# Altium schematic sheet BIN.SchDoc
size A; CompanyName: Microchip Technology Inc.; Organization: Microchip Technology; Address1: 2355 West Chandler Blvd.; Address2: Chandler, AZ  85224; Address4: USA; DocumentNumber: 4; SheetNumber: 4; SheetTotal: 5; SheetTitle: Bus Interface Network; Time: Time
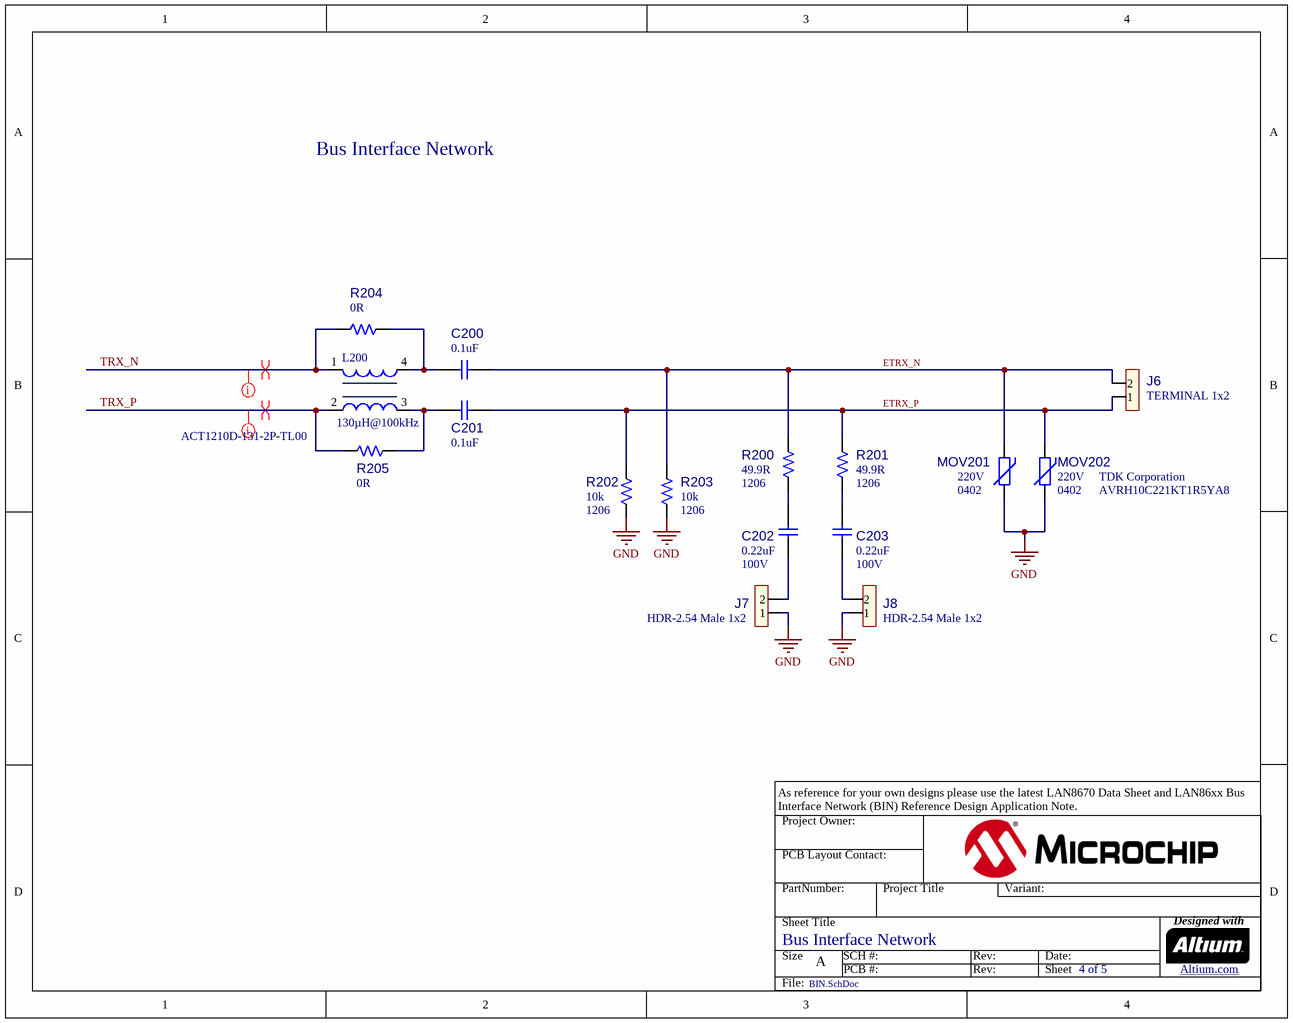
[diagram p0: BIN.SchDoc]

## Parts
C200  value 0.1uF  [CAP_C_0402]  (hidden comment: Capacitor NP)
C201  value 0.1uF  [CAP_C_0402]  (hidden comment: Capacitor NP)
C202  value 0.22uF  Voltage: 100V  [CAP_C_0805]  (hidden comment: Capacitor NP)
C203  value 0.22uF  Voltage: 100V  [CAP_C_0805]  (hidden comment: Capacitor NP)
J6  value TERMINAL 1x2  [CON_TB_3.5mm_2POS_WE_WR-TBL-691214110002S]  (hidden comment: Header 1x2)
J7  value HDR-2.54 Male 1x2  [HDR_M_2.54_1x2]  (hidden comment: Header 1x2)
J8  value HDR-2.54 Male 1x2  [HDR_M_2.54_1x2]  (hidden comment: Header 1x2)
L200  value 130µH@100kHz  Manufacturer Part Number 1: ACT1210D-131-2P-TL00  [IND_TDK_ACT1210D_L3.9W2.5H2.5]  (hidden comment: Inductor Choke ACT1210)
MOV201  value 220V  Package: 0402  [RES_C_0402]  (hidden comment: Varistor)
MOV202  value 220V  Package: 0402  Manufacturer 1: TDK Corporation  Manufacturer Part Number 1: AVRH10C221KT1R5YA8  [RES_C_0402]  (hidden comment: Varistor)
R200  value 49.9R  Package: 1206  [RES_C_1206]  (hidden comment: Resistor)
R201  value 49.9R  Package: 1206  [RES_C_1206]  (hidden comment: Resistor)
R202  value 10k  Package: 1206  [RES_C_1206]  (hidden comment: Resistor)
R203  value 10k  Package: 1206  [RES_C_1206]  (hidden comment: Resistor)
R204  value 0R  [RES_C_0402]  (hidden comment: Resistor)
R205  value 0R  [RES_C_0402]  (hidden comment: Resistor)

## Nets
GND: J7.1 J8.1 MOV201.1 MOV202.1 R202.2 R203.2
ETRX_N: C200.2 J6.2 MOV201.2 R200.2 R203.1
ETRX_P: C201.2 J6.1 MOV202.2 R201.2 R202.1
TRX_N: L200.1 R204.1
TRX_P: L200.2 R205.1
NetC200_1: C200.1 L200.4 R204.2
NetC201_1: C201.1 L200.3 R205.2
NetC202_1: C202.1 J7.2
NetC202_2: C202.2 R200.1
NetC203_1: C203.1 J8.2
NetC203_2: C203.2 R201.1

## Layout directives
differential pair: TRX_N, TRX_P
net class 100 Ohm Diff: TRX_N, TRX_P

## Notes on the sheet
- As reference for your own designs please use the latest LAN8670 Data Sheet and LAN86xx Bus Interface Network (BIN) Reference Design Application Note.
- Project Owner:
- PCB Layout Contact:
- PartNumber:
- Project Title
- Variant:
- Sheet Title
- Size
- A
- SCH #:
- PCB #:
- Rev:
- Date:
- Sheet
- Designed with
- Altium.com <http://go.altium.com/MicrochipLandingPage_Evaluation.html>
- File:

## Library data of the parts
C200 C201 = CAP2375: Manufacturer 1: Murata Electronics; Manufacturer Part Number 1: GRM155R71H104KE14J; Voltage: 50V; Tolerance: 10%; Description_: Ceramic capacitor, SMD 0402, X7R, 50V, +/-10%; Temperature Coeffcient: X7R; Type: Ceramic; Owner: Dragos Danaila; Populated: YES; Dev Tools Status: Production; MCHP-ID: CAP2375; Revision: 1; Status: MCL Design; Package: 0402; Operating Temperature: -55C to +125C; Category: Capacitor; Supplier 1: Mouser Electronics; Supplier Part Number 1: 81-GRM155R71H104KE4J; Quantity Override: 1; Symbol: Capacitor NP; ComponentLink1URL: https://chn-vm-apps.microchip.com/mchprepo/parts/Datasheets/murata_03052018_GRM_Series_1-1310166.pdf; ComponentLink1Description: SVN Datasheet; ComponentLink2URL: C:\ALTIUM_WORK\00001_MCHP-CDB\Datasheets\murata_03052018_GRM_Series_1-1310166.pdf; ComponentLink2Description: Local Datasheet; ComponentLink3URL: C:\ALTIUM_WORK\00001_MCHP-CDB\Library\LibraryRefs\Capacitor NP.SchLib; ComponentLink3Description: Open Symbol; ComponentLink4URL: C:\ALTIUM_WORK\00001_MCHP-CDB\Library\Footprints\CAP_C_0402.PcbLib; ComponentLink4Description: Open Footprint; ComponentLink5Description: Open Footprint 2; ComponentLink6Description: Open Footprint 3; ComponentLink7Description: Open Footprint 4
C202 C203 = CAP2522: Manufacturer 1: AVX Corporation; Manufacturer Part Number 1: 08051C224K4T2A; Description_: CAP CER 0.22uF 100V 10% X7R SMD 0805 AEC-Q200; Tolerance: ±10%; Type: Ceramic; Owner: Lori Graham; Populated: YES; Temperature Coeffcient: X7R; Dev Tools Status: Design; MCHP-ID: CAP2522; Package: 0805; Revision: 1; Status: MCL Design; Operating Temperature: -55°C to +125°C; Category: Capacitor; Supplier 1: Digi-Key; Supplier Part Number 1: 478-13049-1-ND; Quantity Override: 1; Symbol: Capacitor NP; ComponentLink1URL: https://chn-vm-apps.microchip.com/mchprepo/parts/Datasheets/AVX_08051C224K4T2A; ComponentLink1Description: SVN Datasheet; ComponentLink2URL: C:\ALTIUM_WORK\00001_MCHP-CDB\Datasheets\AVX_08051C224K4T2A; ComponentLink2Description: Local Datasheet; ComponentLink3URL: C:\ALTIUM_WORK\00001_MCHP-CDB\Library\LibraryRefs\Capacitor NP.SchLib; ComponentLink3Description: Open Symbol; ComponentLink4URL: C:\ALTIUM_WORK\00001_MCHP-CDB\Library\Footprints\CAP_C_0805.PcbLib; ComponentLink4Description: Open Footprint; ComponentLink5Description: Open Footprint 2; ComponentLink6Description: Open Footprint 3; ComponentLink7Description: Open Footprint 4
J6 = CON2397: Manufacturer 1: WUERTH ELEKTRONIK; Manufacturer Part Number 1: 691214110002S; Description_: CON TERMINAL 3.5mm 1x2 Female 16-30AWG 10A TH R/A; Owner: Lori Graham; Populated: YES; Dev Tools Status: Design; Voltage: 300V; Current: 10A; MCHP-ID: CON2397; Revision: 1; Status: MCL Design; Type: Terminal Block; Category: Connector; Supplier 1: Digi-Key; Supplier Part Number 1: 732-691214110002S-ND; Quantity Override: 1; Symbol: Header 1x2; ComponentLink1URL: https://chn-vm-apps.microchip.com/mchprepo/parts/Datasheets/6912141100xxS.pdf; ComponentLink1Description: SVN Datasheet; ComponentLink2URL: C:\ALTIUM_WORK\00001_MCHP-CDB\Datasheets\6912141100xxS.pdf; ComponentLink2Description: Local Datasheet; ComponentLink3URL: C:\ALTIUM_WORK\00001_MCHP-CDB\Library\LibraryRefs\Header 1x2.SchLib; ComponentLink3Description: Open Symbol; ComponentLink4URL: C:\ALTIUM_WORK\00001_MCHP-CDB\Library\Footprints\CON_TB_3.5mm_2POS_WE_WR-TBL-691214110002S.PcbLib; ComponentLink4Description: Open Footprint; ComponentLink5Description: Open Footprint 2; ComponentLink6Description: Open Footprint 3; ComponentLink7Description: Open Footprint 4; Operating Temperature: -30C to +120C
J7 J8 = CON2326: Manufacturer 1: Samtec Inc; Manufacturer Part Number 1: TSW-102-23-F-S; Description_: CON HDR-2.54 M 1x2 5.84MH TH VERT; Owner: Lori Graham; Populated: YES; Dev Tools Status: Design; MCHP-ID: CON2326; Revision: 1; Status: MCL Design; Type: Header 2.54mm; Category: Connector; Supplier 1: Digi-Key; Supplier Part Number 1: SAM10326-ND; Quantity Override: 1; Symbol: Header 1x2; ComponentLink1URL: https://chn-vm-apps.microchip.com/mchprepo/parts/Datasheets/Samtec_TSW_102-23-F-S; ComponentLink1Description: SVN Datasheet; ComponentLink2URL: C:\ALTIUM_WORK\00001_MCHP-CDB\Datasheets\Samtec_TSW_102-23-F-S; ComponentLink2Description: Local Datasheet; ComponentLink3URL: C:\ALTIUM_WORK\00001_MCHP-CDB\Library\LibraryRefs\Header 1x2.SchLib; ComponentLink3Description: Open Symbol; ComponentLink4URL: C:\ALTIUM_WORK\00001_MCHP-CDB\Library\Footprints\HDR_M_2.54_1x2.PcbLib; ComponentLink4Description: Open Footprint; ComponentLink5Description: Open Footprint 2; ComponentLink6Description: Open Footprint 3; ComponentLink7Description: Open Footprint 4; Operating Temperature: -55°C ~ 125°C
L200 = IND1953: Manufacturer 1: TDK Corporation; Description_: CM CHOKE 6.7k@10MHz 3.5R SMD 1210 AEC-Q200; Type: CM Choke; Owner: Joerg Buehrer; DCR: 3.5R; Dev Tools Status: Design; Test Frequency: 10MHz; Populated: YES; BOM Notes: Alternate:  ACT1210D-101-2P-TL00 or ACT1210R-101-2P-TL00; MCHP-ID: IND1953; Revision: 2; Status: MCL Design; Operating Temperature: -40°C ~ 150°C; Package: 1210; Category: Inductor; Supplier 1: TDK Corporation; Supplier Part Number 1: ACT1210D-131-2P-TL00; Quantity Override: 1; Symbol: Inductor Choke ACT1210; ComponentLink1URL: https://chn-vm-apps.microchip.com/mchprepo/parts/Datasheets/cmf_automotive_signal_act1210d_en.pdf; ComponentLink1Description: SVN Datasheet; ComponentLink2URL: C:\ALTIUM_WORK\00001_MCHP-CDB\Datasheets\cmf_automotive_signal_act1210d_en.pdf; ComponentLink2Description: Local Datasheet; ComponentLink3URL: C:\ALTIUM_WORK\00001_MCHP-CDB\Library\LibraryRefs\Inductor Choke ACT1210.SchLib; ComponentLink3Description: Open Symbol; ComponentLink4URL: C:\ALTIUM_WORK\00001_MCHP-CDB\Library\Footprints\IND_TDK_ACT1210D_L3.9W2.5H2.5.PcbLib; ComponentLink4Description: Open Footprint; ComponentLink5Description: Open Footprint 2; ComponentLink6Description: Open Footprint 3; ComponentLink7Description: Open Footprint 4
MOV201 = RES2490: Manufacturer 1: TDK Corporation; Manufacturer Part Number 1: AVRH10C221KT1R5YA8; Description_: RES VARISTOR C 220V 0.01J SMD 0402; Dev Tools Status: Design; Current: 1A; Owner: Sam Charles; Populated: YES; MCHP-ID: RES2490; Revision: 1; Symbol: Varistor; Status: MCL Design; ComponentLink1URL: https://chn-vm-apps.microchip.com/mchprepo/parts/Datasheets/vpd_automotive_varistors_avr_en.pdf; ComponentLink1Description: SVN Datasheet; ComponentLink2URL: C:\ALTIUM_WORK\00001_MCHP-CDB\Datasheets\vpd_automotive_varistors_avr_en.pdf; ComponentLink2Description: Local Datasheet; ComponentLink3URL: C:\ALTIUM_WORK\00001_MCHP-CDB\Library\LibraryRefs\Varistor.SchLib; ComponentLink3Description: Open Symbol; ComponentLink4URL: C:\ALTIUM_WORK\00001_MCHP-CDB\Library\Footprints\RES_C_0402.PcbLib; ComponentLink4Description: Open Footprint; ComponentLink5Description: Open Footprint 2; ComponentLink6Description: Open Footprint 3; ComponentLink7Description: Open Footprint 4; Operating Temperature: -55°C ~ 150°C; Category: Resistor; Type: Varistor; Voltage: 220V; Composition: C; Supplier 1: Digi-Key; Supplier Part Number 1: 445-AVRH10C221KT1R5YA8CT-ND; Quantity Override: 1
MOV202 = RES2490: Description_: RES VARISTOR C 220V 0.01J SMD 0402; Dev Tools Status: Design; Current: 1A; Owner: Sam Charles; Populated: YES; MCHP-ID: RES2490; Revision: 1; Symbol: Varistor; Status: MCL Design; ComponentLink1URL: https://chn-vm-apps.microchip.com/mchprepo/parts/Datasheets/vpd_automotive_varistors_avr_en.pdf; ComponentLink1Description: SVN Datasheet; ComponentLink2URL: C:\ALTIUM_WORK\00001_MCHP-CDB\Datasheets\vpd_automotive_varistors_avr_en.pdf; ComponentLink2Description: Local Datasheet; ComponentLink3URL: C:\ALTIUM_WORK\00001_MCHP-CDB\Library\LibraryRefs\Varistor.SchLib; ComponentLink3Description: Open Symbol; ComponentLink4URL: C:\ALTIUM_WORK\00001_MCHP-CDB\Library\Footprints\RES_C_0402.PcbLib; ComponentLink4Description: Open Footprint; ComponentLink5Description: Open Footprint 2; ComponentLink6Description: Open Footprint 3; ComponentLink7Description: Open Footprint 4; Operating Temperature: -55°C ~ 150°C; Category: Resistor; Type: Varistor; Voltage: 220V; Composition: C; Supplier 1: Digi-Key; Supplier Part Number 1: 445-AVRH10C221KT1R5YA8CT-ND; Quantity Override: 1
R200 R201 = RES2766: Manufacturer 1: Vishay Dale; Manufacturer Part Number 1: TNPW120649R9BEEA; Description_: RES TF 49.9R 0.1% 0.4W SMD 1206 AEC-Q200; Voltage: 200V; Tolerance: ±0.1%; Temperature Coeffcient: ±25ppm/°C; Power: 0.4W, 2/5W; Owner: Lori Graham; Populated: YES; Dev Tools Status: Design; MCHP-ID: RES2766; Revision: 2; Status: MCL Design; Operating Temperature: -55°C to +155°C; Category: Resistor; Type: RES SMD; Composition: TF; Supplier 1: Digi-Key; Supplier Part Number 1: TNP49.9ACCT-ND; Quantity Override: 1; Symbol: Resistor; ComponentLink1URL: https://chn-vm-apps.microchip.com/mchprepo/parts/Datasheets/tnpw_e3; ComponentLink1Description: SVN Datasheet; ComponentLink2URL: C:\ALTIUM_WORK\00001_MCHP-CDB\Datasheets\tnpw_e3; ComponentLink2Description: Local Datasheet; ComponentLink3URL: C:\ALTIUM_WORK\00001_MCHP-CDB\Library\LibraryRefs\Resistor.SchLib; ComponentLink3Description: Open Symbol; ComponentLink4URL: C:\ALTIUM_WORK\00001_MCHP-CDB\Library\Footprints\RES_C_1206.PcbLib; ComponentLink4Description: Open Footprint; ComponentLink5Description: Open Footprint 2; ComponentLink6Description: Open Footprint 3; ComponentLink7Description: Open Footprint 4
R202 R203 = RES2292: Manufacturer 1: Panasonic Electronic Components; Manufacturer Part Number 1: ERJ-8ENF1002V; Tolerance: 1%; Description_: RES TKF 10k 1% 1/4W SMD 1206 AEC-Q200; Dev Tools Status: Design; Temperature Coeffcient: 100ppm/C; Power: 1/4W; Owner: Gabor Bihari; Populated: YES; MCHP-ID: RES2292; Revision: A; Status: MCL Design; ComponentLink1URL: https://chn-vm-apps.microchip.com/mchprepo/parts/Datasheets/AOA0000C304.pdf; ComponentLink1Description: SVN Datasheet; Operating Temperature: -55°C - 155°C; Category: Resistor; Type: RES SMD; Composition: TKF; Supplier 1: Digi-Key; Supplier Part Number 1: P10.0KFCT-ND; Quantity Override: 1; Symbol: Resistor; ComponentLink2URL: C:\ALTIUM_WORK\00001_MCHP-CDB\Datasheets\AOA0000C304.pdf; ComponentLink2Description: Local Datasheet; ComponentLink3URL: C:\ALTIUM_WORK\00001_MCHP-CDB\Library\LibraryRefs\Resistor.SchLib; ComponentLink3Description: Open Symbol; ComponentLink4URL: C:\ALTIUM_WORK\00001_MCHP-CDB\Library\Footprints\RES_C_1206.PcbLib; ComponentLink4Description: Open Footprint; ComponentLink5Description: Open Footprint 2; ComponentLink6Description: Open Footprint 3; ComponentLink7Description: Open Footprint 4
R204 R205 = RSMT1246: Manufacturer 1: Panasonic Electronic Components; Manufacturer Part Number 1: ERJ-2GE0R00X; Tolerance: 50mOhm; Description_: RES TKF 0R 1/10W SMD 0402; Dev Tools Status: Design; Voltage: 50V; Current: 1A; Power: 1/10W; Owner: Dragos Danaila; Populated: Yes; MCHP-ID: RSMT1246; Package: 0402; Revision: A; Symbol: Resistor; Status: MCL Design; ComponentLink1URL: https://chn-vm-apps.microchip.com/mchprepo/parts/Datasheets/DMA0000COL9.pdf; ComponentLink1Description: SVN Datasheet; ComponentLink2URL: C:\ALTIUM_WORK\00001_MCHP-CDB\Datasheets\DMA0000COL9.pdf; ComponentLink2Description: Local Datasheet; ComponentLink3URL: C:\ALTIUM_WORK\00001_MCHP-CDB\Library\LibraryRefs\Resistor.SchLib; ComponentLink3Description: Open Symbol; ComponentLink4URL: C:\ALTIUM_WORK\00001_MCHP-CDB\Library\Footprints\RES_C_0402.PcbLib; ComponentLink4Description: Open Footprint; ComponentLink5Description: Open Footprint 2; ComponentLink6Description: Open Footprint 3; ComponentLink7Description: Open Footprint 4; Operating Temperature: -55C to +155C; Category: Resistor; Type: RES SMD; Composition: TKF; Supplier 1: Digi-Key; Supplier Part Number 1: P0.0JCT-ND; Quantity Override: 1